# Altium schematic sheet Fleet-Monitor-CAN-Filter.SchDoc: Fleet Monitor
size A4; Subtitle: CAN Filter; DocumentNumber: 3; Revision: V1.0; SheetNumber: 5; SheetTotal: 8; Author: Florian Baumgartner & Luca Jost
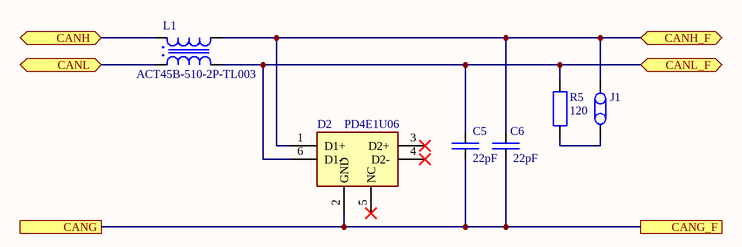
[diagram p0: Fleet-Monitor-CAN-Filter.SchDoc]

## Parts
C5  22pF  [SMD Keramikkondensator 0603]
C6  22pF  [SMD Keramikkondensator 0603]
D2  PD4E1U06  [SMD IC SOT-363 (SC-70-6)]
J1  X-Jumper (2 Fach)  [THT  Jumper]  (value not drawn)
L1  ACT45B-510-2P-TL003  [SMD Common Mode Choke 4.5x3.2]
R5  120  [SMD Widerstand 0603]

## Ports
CANG, CANG_F, CANH (bidir), CANH_F (bidir), CANL (bidir), CANL_F (bidir)

## Nets
CANG: C5.1 C6.1 D2.2(GND) ; port CANG, port CANG_F
CANH: L1.4 ; port CANH
CANH_F: C6.2 D2.1(D1+) J1.2 L1.3 ; port CANH_F
CANL: L1.1 ; port CANL
CANL_F: C5.2 D2.6(D1-) L1.2 R5.2 ; port CANL_F
NetJ1_1: J1.1 R5.1

Not connected (* = marked no-connect by the designer): D2 3(D2+)* 4(D2-)* 5(NC)*

## Notes on the sheet
- Title
- Author:
- Subtitle
- Date:
- Rev:
- File:
- Sheet
- of

## Library data of the parts
C5 C6 = E6 - 22pF: SMD Ceramic Capacitor E6; Component Value: 22pF 50V; Component Description: Multilayer Ceramic Capacitors MLCC; ComponentLink1Description: Datasheet; ComponentLink1URL: https://datasheet.lcsc.com/lcsc/1810121815_Samsung-Electro-Mechanics-CL10C220JB8NNNC_C1653.pdf; Digikey: 1276-1023-1-ND; Farnell: 2332643; JLC-Parts: C1653; Mouser: 187-CL10C220JB8NNNC; Unit Price: 0.01
D2 = PD4E1U06DCKR: Unidirectional 3A (8/20us) 15V (Typ) 6.5V 5.5V (Max) SOT-363 ESD Protection Devices ROHS; Component Description: ESD Suppressor; ComponentLink1Description: Datasheet; ComponentLink1URL: https://datasheet.lcsc.com/lcsc/1810172210_Texas-Instruments-TPD4E1U06DCKR_C194628.pdf; Component Value: PD4E1U06; Digikey: 296-39347-1-ND; Farnell: 3116516; JLC-Parts: C194628; Mouser: 595-TPD4E1U06DCKR; Unit Price: 0.12
J1 = X-Jumper (2 Fach): Component Value: 2-Pol; Component Description: Through Hole Jumper; Digikey: WM50016-02-ND; Farnell: 2668454; Mouser: 538-22-28-4023; Unit Price: 0.01; ComponentLink1Description: Datasheet; ComponentLink1URL: https://datasheet.lcsc.com/lcsc/1912111437_PINREX-210-91-02GB01_C390678.pdf; JLC-Parts: C358684
L1 = ACT45B-510-2P-TL003: 51uH @ 100kHz 2.8kΩ @ 10MHz 50V 1Ω Signal Line 4532 Common Mode Filters ROHS; Component Value: ACT45B-101-2P-TL003; ComponentLink1Description: Datasheet; ComponentLink1URL: https://datasheet.lcsc.com/lcsc/1811151538_TDK-ACT45B-101-2P-TL003_C88056.pdf; Digikey: 445-3959-1-ND; Farnell: 3407556; JLC-Parts: C88056; Mouser: 810-ACT45B1012PTL003; Unit Price: 0.56; Component Description: Common Mode Filter
R5 = E24 - 120: SMD Chip Resistor E24; Component Value: 120 (75V, 100mW, 1%); ComponentLink1Description: Datasheet; ComponentLink1URL: https://datasheet.lcsc.com/lcsc/1810200710_UNI-ROYAL-Uniroyal-Elec-0603WAF4701T5E_C23162.pdf; Digikey: P120HCT-ND; Farnell: 2303067; JLC-Parts: C22787; Mouser: 667-ERJ-3EKF1200V; Unit Price: 0.01; Component Description: Chip Resistor